# Altium schematic sheet KursSCH4.schdoc
size 420 x 297 mm; DocumentNumber: СПбПУ 12.03.2019 + Э3; SheetNumber: 4; SheetTotal: 4; Format: A3
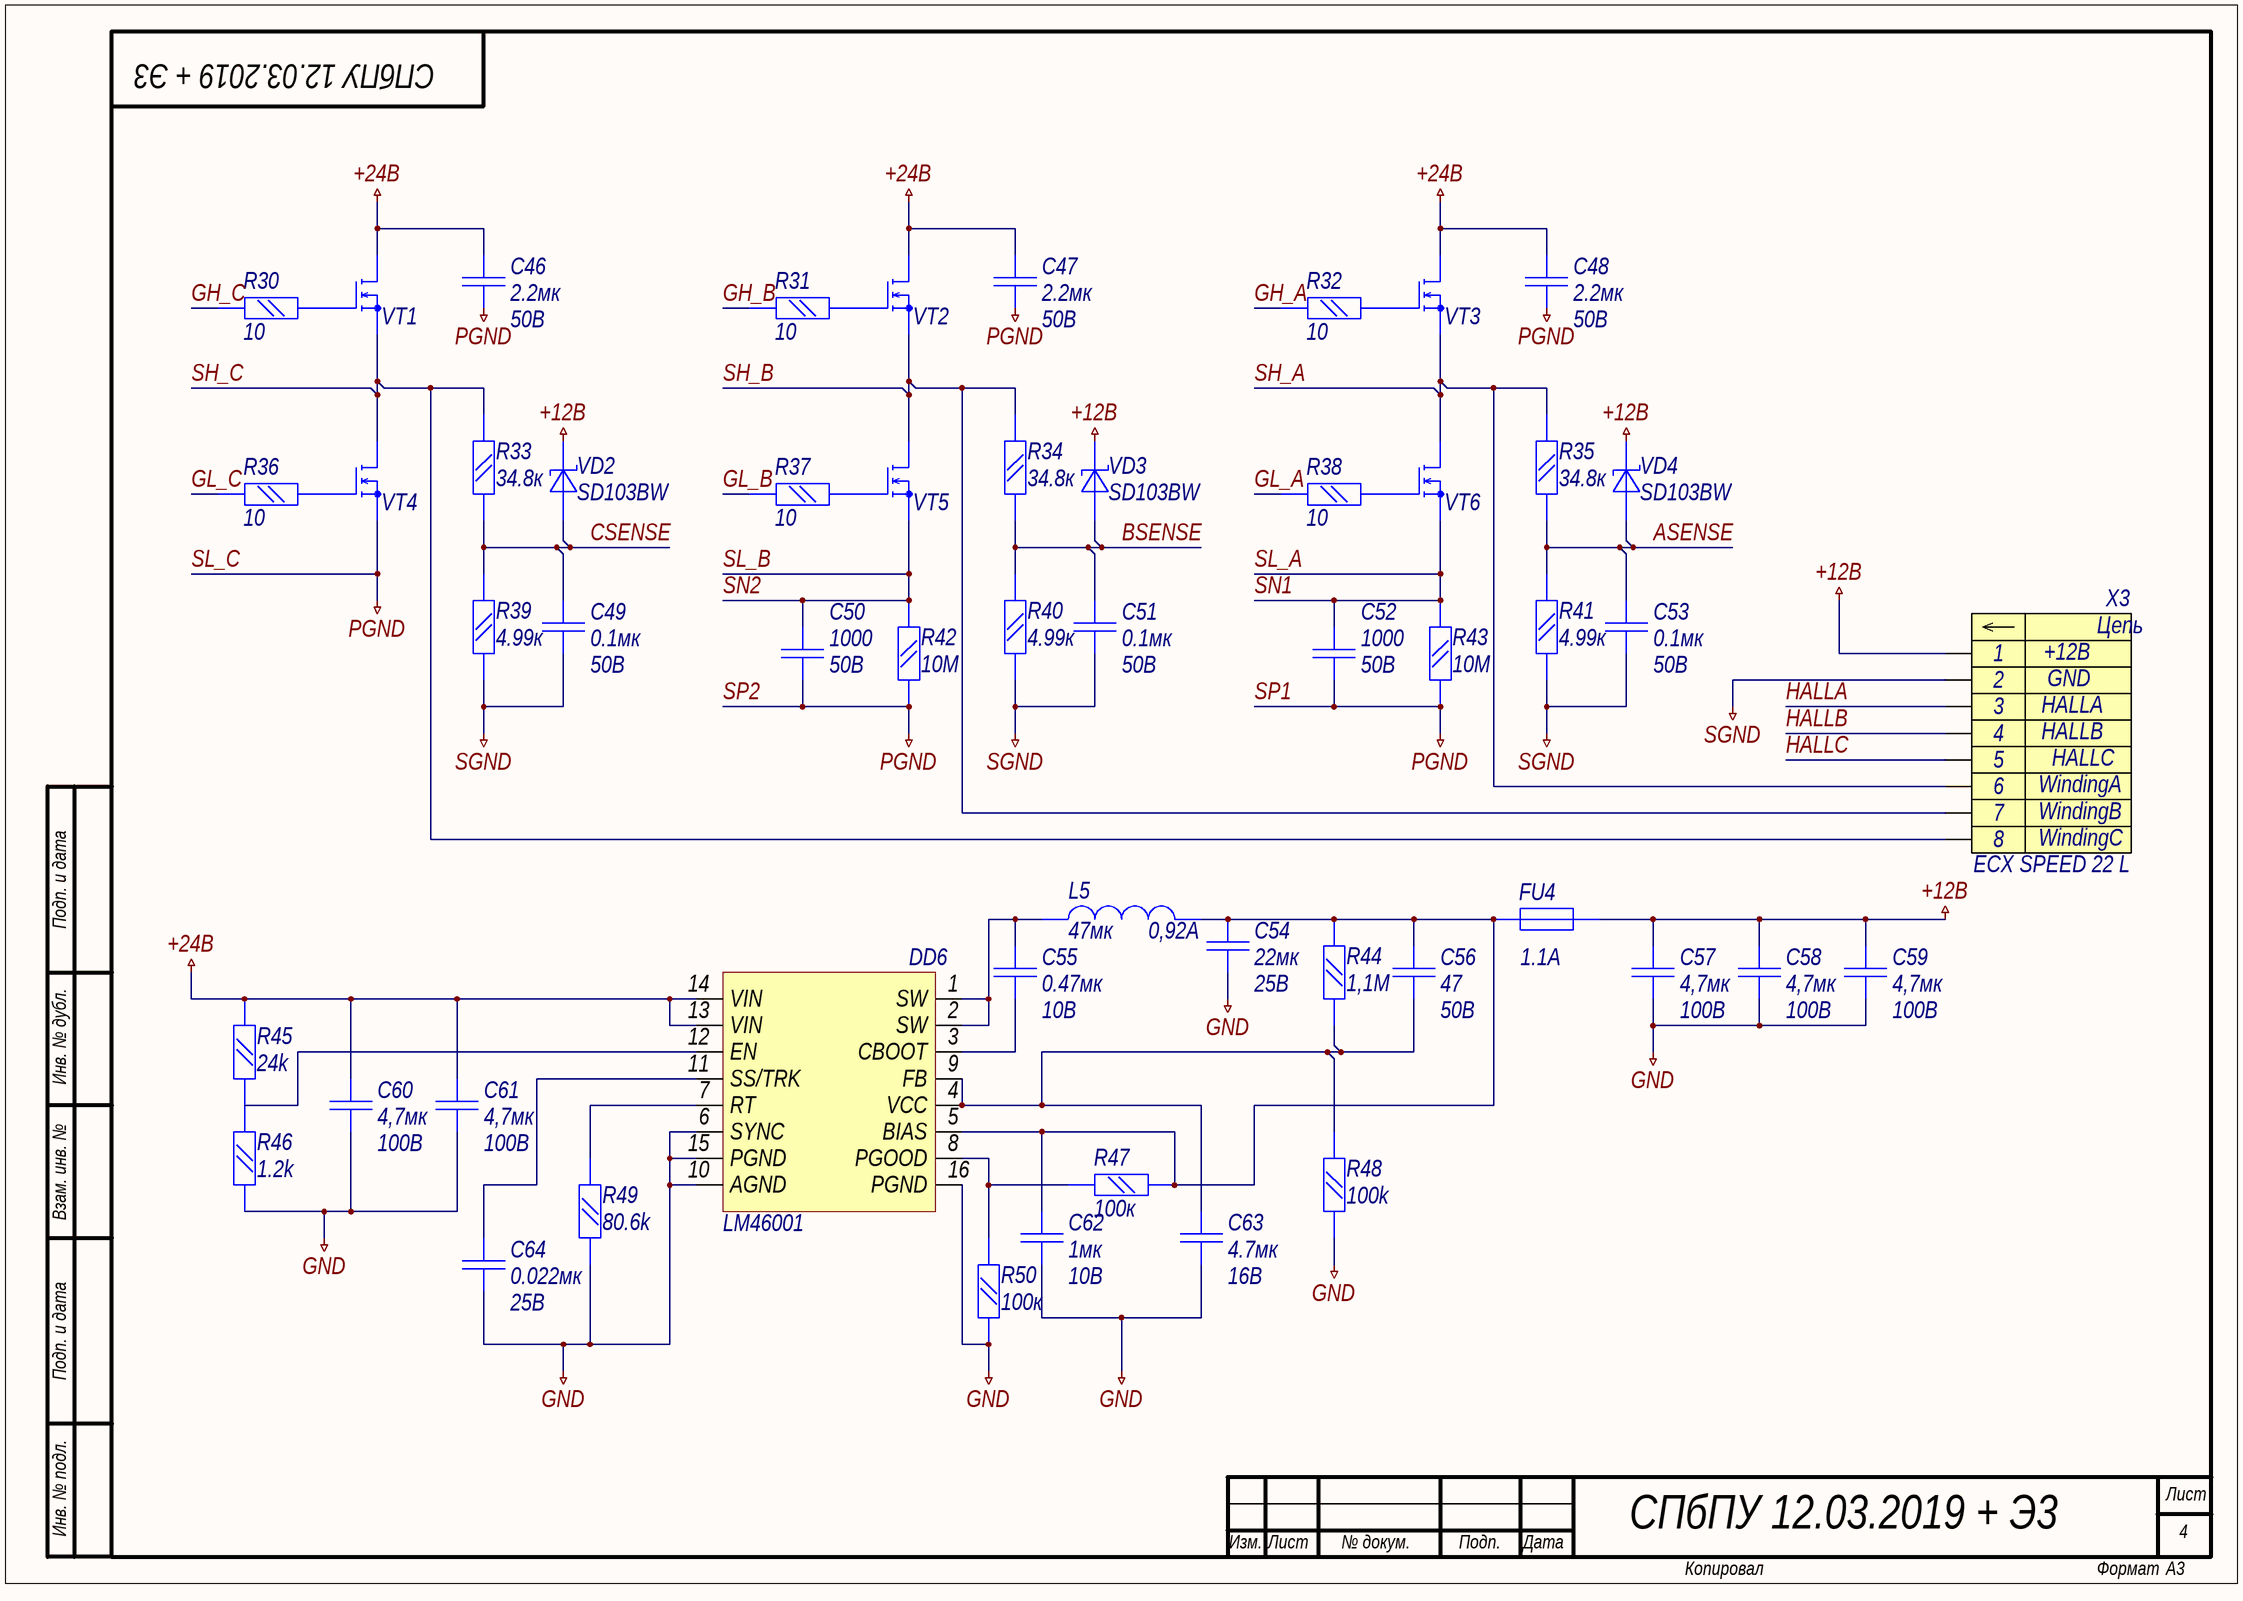
[diagram p0: KursSCH4.schdoc]

## Parts
C46  value 2.2мк  Voltage: 50В  [C0603]  (hidden comment: Capacitor)
C47  value 2.2мк  Voltage: 50В  [C0603]  (hidden comment: Capacitor)
C48  value 2.2мк  Voltage: 50В  [C0603]  (hidden comment: Capacitor)
C49  value 0.1мк  Voltage: 50В  [C0805]  (hidden comment: Capacitor)
C50  value 1000  Voltage: 50В  [C0402]  (hidden comment: Capacitor)
C51  value 0.1мк  Voltage: 50В  [C0805]  (hidden comment: Capacitor)
C52  value 1000  Voltage: 50В  [C0402]  (hidden comment: Capacitor)
C53  value 0.1мк  Voltage: 50В  [C0805]  (hidden comment: Capacitor)
C54  value 22мк  Voltage: 25В  [C0805]  (hidden comment: Capacitor)
C55  value 0.47мк  Voltage: 10В  [C0603]  (hidden comment: Capacitor)
C56  value 47  Voltage: 50В  [C0402]  (hidden comment: Capacitor)
C57  value 4,7мк  Voltage: 100В  [C1206]  (hidden comment: Capacitor)
C58  value 4,7мк  Voltage: 100В  [C1206]  (hidden comment: Capacitor)
C59  value 4,7мк  Voltage: 100В  [C1206]  (hidden comment: Capacitor)
C60  value 4,7мк  Voltage: 100В  [C1206]  (hidden comment: Capacitor)
C61  value 4,7мк  Voltage: 100В  [C1206]  (hidden comment: Capacitor)
C62  value 1мк  Voltage: 10В  [C0603]  (hidden comment: Capacitor)
C63  value 4.7мк  Voltage: 16В  [C0603]  (hidden comment: Capacitor)
C64  value 0.022мк  Voltage: 25В  [C0603]  (hidden comment: Capacitor)
DD6  LM46001  [LM46001]
FU4  Rated Current: 1.1A  [F1812]  (hidden comment: Fuse)
L5  I: 0,92А  L: 47мк  [747779115]  (hidden comment: 7447779115)
R30  value 10  [R0805]  (hidden comment: Resistor_0,125W)
R31  value 10  [R0805]  (hidden comment: Resistor_0,125W)
R32  value 10  [R0805]  (hidden comment: Resistor_0,125W)
R33  value 34.8к  [R0805]  (hidden comment: Resistor_0,125W)
R34  value 34.8к  [R0805]  (hidden comment: Resistor_0,125W)
R35  value 34.8к  [R0805]  (hidden comment: Resistor_0,125W)
R36  value 10  [R0805]  (hidden comment: Resistor_0,125W)
R37  value 10  [R0805]  (hidden comment: Resistor_0,125W)
R38  value 10  [R0805]  (hidden comment: Resistor_0,125W)
R39  value 4.99к  [R0603]  (hidden comment: Resistor_0,125W)
R40  value 4.99к  [R0603]  (hidden comment: Resistor_0,125W)
R41  value 4.99к  [R0603]  (hidden comment: Resistor_0,125W)
R42  value 10М  [R0603]  (hidden comment: Resistor_0,125W)
R43  value 10М  [R0603]  (hidden comment: Resistor_0,125W)
R44  value 1,1М  [R0805]  (hidden comment: Resistor_0,125W)
R45  value 24k  [R0603]  (hidden comment: Resistor_0,125W)
R46  value 1.2k  [R0603]  (hidden comment: Resistor_0,125W)
R47  value 100к  [R0805]  (hidden comment: Resistor_0,125W)
R48  value 100k  [R0805]  (hidden comment: Resistor_0,125W)
R49  value 80.6k  [R0603]  (hidden comment: Resistor_0,125W)
R50  value 100к  [R0805]  (hidden comment: Resistor_0,125W)
VD2  Part Number: SD103BW  [SOD-123]  (hidden comment: Schottky)
VD3  Part Number: SD103BW  [SOD-123]  (hidden comment: Schottky)
VD4  Part Number: SD103BW  [SOD-123]  (hidden comment: Schottky)
VT1  MOSFET-N  [SOT-23]  (value not drawn)
VT2  MOSFET-N  [SOT-23]  (value not drawn)
VT3  MOSFET-N  [SOT-23]  (value not drawn)
VT4  MOSFET-N  [SOT-23]  (value not drawn)
VT5  MOSFET-N  [SOT-23]  (value not drawn)
VT6  MOSFET-N  [SOT-23]  (value not drawn)
X3  ECX SPEED 22 L  U: +12В  Hall1: HALLA  Hall2: HALLB  Hall3: HALLC  Winding1: WindingA  Winding2: WindingB  Winding3: WindingC  [USB]

## Nets
+12В: C57.2 C58.2 C59.2 FU4.2 VD2.2(К) VD3.2(К) VD4.2(К) X3.1
+24В: C46.2 C47.2 C48.2 C60.2 C61.2 DD6.13(VIN) DD6.14(VIN) R45.2 VT1.2(D) VT2.2(D) VT3.2(D)
GND: C54.1 C57.1 C58.1 C59.1 C60.1 C61.1 C62.1 C63.1 C64.2 DD6.6(SYNC) DD6.10(AGND) DD6.15(PGND) DD6.16(PGND) R46.1 R48.1 R49.1 R50.1
SGND: C49.1 C51.1 C53.1 R39.1 R40.1 R41.1 X3.2
SL_C: C46.1 C47.1 C48.1 C50.1 C52.1 R42.1 R43.1 VT4.3(S)  [also labelled PGND, SP1, SP2]
ASENSE: C53.2 R35.1 R41.2 VD4.1(А)
BSENSE: C51.2 R34.1 R40.2 VD3.1(А)
CSENSE: C49.2 R33.1 R39.2 VD2.1(А)
GH_A: R32.1
GH_B: R31.1
GH_C: R30.1
GL_A: R38.1
GL_B: R37.1
GL_C: R36.1
HALLA: X3.3
HALLB: X3.4
HALLC: X3.5
SH_A: R35.2 VT3.3(S) VT6.2(D) X3.6
SH_B: R34.2 VT2.3(S) VT5.2(D) X3.7
SH_C: R33.2 VT1.3(S) VT4.2(D) X3.8
SL_A: C52.2 R43.2 VT6.3(S)  [also labelled SN1]
SL_B: C50.2 R42.2 VT5.3(S)  [also labelled SN2]
NetC54_2: C54.2 C56.2 C62.2 DD6.5(BIAS) FU4.1 L5.2 R44.2 R47.2
NetC55_1: C55.1 DD6.3(CBOOT)
NetC55_2: C55.2 DD6.1(SW) DD6.2(SW) L5.1
NetC56_1: C56.1 C63.2 DD6.4(VCC) DD6.9(FB) R44.1 R48.2
NetC64_1: C64.1 DD6.11(SS/TRK)
NetDD6_7: DD6.7(RT) R49.2
NetDD6_8: DD6.8(PGOOD) R47.1 R50.2
NetDD6_12: DD6.12(EN) R45.1 R46.2
NetR30_2: R30.2 VT1.1(G)
NetR31_2: R31.2 VT2.1(G)
NetR32_2: R32.2 VT3.1(G)
NetR36_2: R36.2 VT4.1(G)
NetR37_2: R37.2 VT5.1(G)
NetR38_2: R38.2 VT6.1(G)

## Notes on the sheet
- Подп. и дата
- Инв. № дубл.
- Взам. инв. №
- Инв. № подл.
- Лист
- Изм.
- № докум.
- Подп.
- Дата
- Копировал
- Формат
- (in symbol ECX SPEED 22 L) Цепь

## Library data of the parts
C46-C48 = GRM188R61C225KE15D: Manufacturer: Murata; Type: Конденсатор; ID: 152; Tolerance: ±10%; Dielectric Type: X5R; Application Category: 1; Working Temperature Min: -55°С; Working Temperature Max: +85°С; Part Number: GRM188R61C225KE15D; Footprint: 0603
C49 C51 C53 = GRM21BR71H104KA01L: Manufacturer: Murata; Type: Конденсатор; ID: 138; Tolerance: ±10%; Dielectric Type: X7R; Application Category: 1; Working Temperature Min: -55°С; Working Temperature Max: +125°С; Part Number: GRM21BR71H104KA01L; Footprint: 0805
C50 C52 = GRM155R71H102KA01D: Manufacturer: Murata; Type: Конденсатор; ID: 202; Tolerance: ±10%; Dielectric Type: X7R; Application Category: 1; Working Temperature Min: -55°С; Working Temperature Max: +125°С; Part Number: GRM155R71H102KA01D; Footprint: 0402
C54 = GRM21BR61E226ME44L: Manufacturer: Murata; Type: Конденсатор; ID: 39; Tolerance: ±20%; Dielectric Type: X5R; Part Number: GRM21BR61E226ME44L; Footprint: 0805
C55 = GRM188R71A474KA61D: Manufacturer: Murata; Type: Конденсатор; ID: 133; Tolerance: ±10%; Dielectric Type: X7R; Application Category: 1; Working Temperature Min: -55°С; Working Temperature Max: +125°С; Part Number: GRM188R71A474KA61D; Footprint: 0603
C56 = GRM1535C1H470JDD5D: Manufacturer: Murata; Type: Конденсатор; ID: 190; Tolerance: ±5%; Dielectric Type: NP0; Application Category: 1; Working Temperature Min: -55°С; Working Temperature Max: +125°С; Part Number: GRM1535C1H470JDD5D; Footprint: 0402
C57-C61 = GRM31CR61H106KA12L: Part Number: GRM31CC72A475ME11; Manufacturer: Murata; Type: Конденсатор; ID: 143; Tolerance: ±10%; Dielectric Type: X7S; Application Category: 1; Working Temperature Min: -55°С; Working Temperature Max: +125°С; Footprint: 1206
C62 = GRM188R61A105KA01D: Manufacturer: Murata; Type: Конденсатор; ID: 134; Tolerance: ±10%; Dielectric Type: X5R; Application Category: 1; Working Temperature Min: -55°С; Working Temperature Max: +85°С; Part Number: GRM188R61A105KA01D; Footprint: 0603
C63 = GRM188R61A475KE15D: Manufacturer: Murata; Type: Конденсатор; ID: 175; Tolerance: ±10%; Dielectric Type: X5R; Application Category: 1; Part Number: GRM188R61A475KE15D; Footprint: 0603
C64 = GRM188R71E223JA01D: Manufacturer: Murata; Type: Конденсатор; ID: 154; Tolerance: ±5%; Dielectric Type: X7R; Application Category: 1; Working Temperature Min: -55°С; Working Temperature Max: +125°С; Part Number: GRM188R71E223JA01D; Footprint: 0603
FU4 = LP-MSM110-2: ID: 2; Limit Voltage: 6В; Resistance: 0.26ohm; Published: 24.09.2010; Publisher: Andrew Danich; Value: LP-MSM110-2; Type: Вставка плавкая
R30-R32 R36-R38 = RC0805JR-0710RL: Manufacturer: Yageo; ID: 96; Limit Voltage: 150V; Tolerance: ±5%; Temperature Coefficient: 100ppm; Total Power Dissipation: 0.125W; Series Type: Thick-Film; Application Category: 1; Working Temperature Min: -55°С; Working Temperature Max: +155°С; Type: Резистор; Part Number: RC0805JR-0710RL; Footprint: 0805
R33-R35 = RC0805FR-0734K8L: Manufacturer: Yageo; ID: 137; Limit Voltage: 150V; Tolerance: ±1%; Temperature Coefficient: 100ppm; Total Power Dissipation: 0.125W; Series Type: Thick-Film; Application Category: 1; Working Temperature Min: -55°С; Working Temperature Max: +155°С; Type: Резистор; Part Number: RC0805FR-0734K8L; Footprint: 0805
R39-R41 = RC0603FR-074K99L: Manufacturer: Yageo; ID: 266; Limit Voltage: 50V; Tolerance: ±1%; Temperature Coefficient: 100ppm; Total Power Dissipation: 0.1W; Series Type: Thick-Film; Application Category: 1; Working Temperature Min: -55°С; Working Temperature Max: +155°С; Type: Резистор; Part Number: RC0603FR-074K99L; Footprint: 0603
R42 R43 = RC0603FR-0710ML: Manufacturer: Yageo; ID: 397; Limit Voltage: 50V; Tolerance: ±1%; Temperature Coefficient: 100ppm; Total Power Dissipation: 0.1W; Series Type: Thick-Film; Application Category: 1; Working Temperature Min: -55°С; Working Temperature Max: +155°С; Type: Резистор; Part Number: RC0603FR-0710ML; Footprint: 0603
R44 = RC0805JR-071M1L: Manufacturer: Yageo; ID: 91; Limit Voltage: 150V; Tolerance: ±5%; Temperature Coefficient: 100ppm; Total Power Dissipation: 0.125W; Series Type: Thick-Film; Application Category: 1; Working Temperature Min: -55°С; Working Temperature Max: +155°С; Type: Резистор; Part Number: RC0805JR-071M1L; Footprint: 0805
R45 = RC0603JR-0724KL: Manufacturer: Yageo; ID: 35; Limit Voltage: 50V; Tolerance: ±5%; Temperature Coefficient: 100ppm; Total Power Dissipation: 0.1W; Series Type: Thick-Film; Application Category: 1; Working Temperature Min: -55°С; Working Temperature Max: +155°С; Type: Резистор; Part Number: RC0603JR-0724KL; Footprint: 0603
R46 = RC0603JR-071K2L: Manufacturer: Yageo; ID: 7; Limit Voltage: 50V; Tolerance: ±5%; Temperature Coefficient: 100ppm; Total Power Dissipation: 0.1W; Series Type: Thick-Film; Application Category: 1; Working Temperature Min: -55°С; Working Temperature Max: +155°С; Type: Резистор; Part Number: RC0603JR-071K2L; Footprint: 0603
R47 R48 R50 = RC0805JR-07100KL: Manufacturer: Yageo; ID: 98; Limit Voltage: 150V; Tolerance: ±5%; Temperature Coefficient: 100ppm; Total Power Dissipation: 0.125W; Series Type: Thick-Film; Application Category: 1; Working Temperature Min: -55°С; Working Temperature Max: +155°С; Type: Резистор; Part Number: RC0805JR-07100KL; Footprint: 0805
R49 = RC0603FR-0780K6L: Manufacturer: Yageo; ID: 325; Limit Voltage: 50V; Tolerance: ±1%; Temperature Coefficient: 100ppm; Total Power Dissipation: 0.1W; Series Type: Thick-Film; Application Category: 1; Working Temperature Min: -55°С; Working Temperature Max: +155°С; Type: Резистор; Part Number: RC0603FR-0780K6L; Footprint: 0603
VD2-VD4 = SD103BW: Type: Диод; ID: 2; Reverse Voltage: 30V; Reverse Current: 5uA; Forward Voltage: 0.37V; Forward Current: 350mA; Total Power Dissipation: 400mW; Capacitance: 28pF; Max Operating Frequency: 10nS; Application Category: 1; Value: SD103BW
VT1-VT6 = 2n7002: Part Number: 2n7002; Manufacturer: Diodes Incorporated; Type: Транзистор; ID: 2; Value: 2N7002; D-S Voltage: 60V; Drain Current: 300mA; D-S On-Resistance: 5omh; Gate Capacitance: 50pF; Total Power Dissipation: 0.83W; Gate Threshold Voltage: 2.5V; Application Category: 1; Working Temperature Min: -55°С; Working Temperature Max: +150°С; Published: 24.09.2010; Publisher: Andrew Danich
X3 = ECX SPEED 22 L: Create: DeathSpeaker; GND: GND
L5 = 7447779115: Name: 7447779115